# EAGLE design BIRDS-5_1U_+X-panel_EM_PUPV_v3.2 (EAGLE 9.6.2)
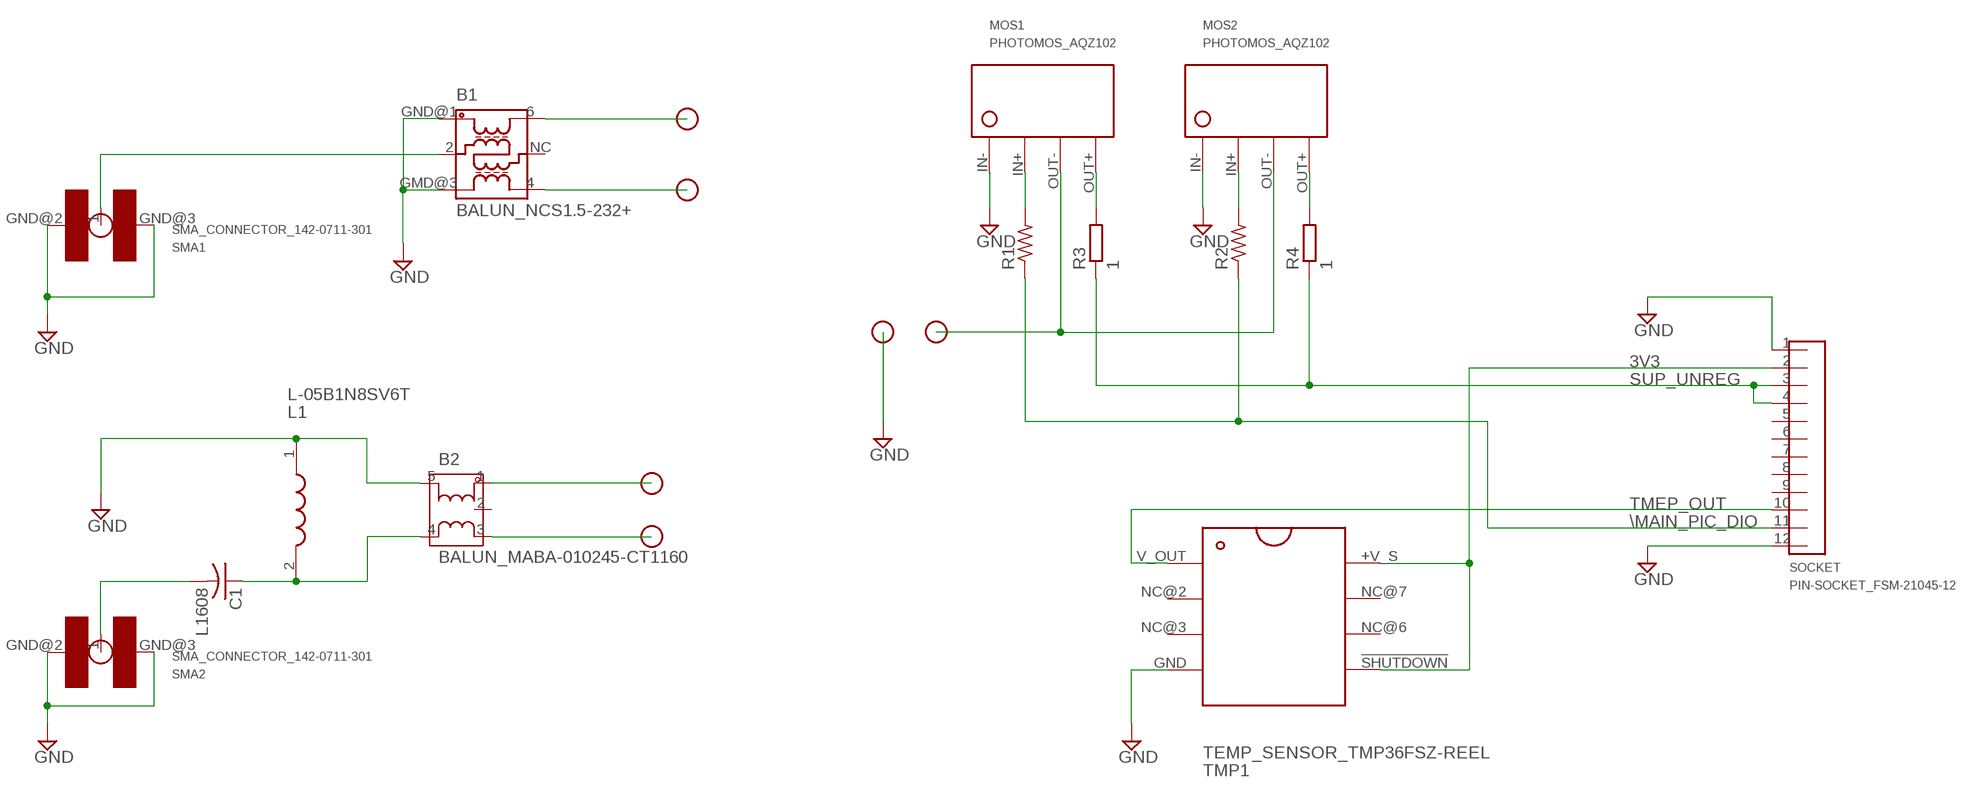
[diagram p0: schematic, sheet 1]

## Parts
B1  BALUN_NCS1.5-232+  [NCS1.5-232+]
B2  BALUN_MABA-010245-CT1160  [MABA-010245-CT1160]
C1  L1608  [L1608]
FD1  FEED_POINT_HEAT_KNIFE  [FEED_POINT_HEAT_KNIFE]
FD2  FEED_POINT_HEAT_KNIFE  [FEED_POINT_HEAT_KNIFE]
FP1_UHF  FEED_POINT  [FEED_POINT]
FP2_UHF  FEED_POINT  [FEED_POINT]
FP3  FEED_POINT  [FEED_POINT]
FP4  FEED_POINT  [FEED_POINT]
L1  L-05B1N8SV6T  [INDC0603X33N]
MOS1  PHOTOMOS_AQZ102  [AQZ102]
MOS2  PHOTOMOS_AQZ102  [AQZ102]
R1  R-US_R0402  [R0402]
R2  R-US_R0402  [R0402]
R3  1  R-EU_R1218  [R1218]
R4  1  R-EU_R1218  [R1218]
SMA1  SMA_CONNECTOR_142-0711-301  [142-0711-301]
SMA2  SMA_CONNECTOR_142-0711-301  [142-0711-301]
SOCKET  PIN-SOCKET_FSM-21045-12  [PIN-SOCKET_FSM-21045-12]
TMP1  TEMP_SENSOR_TMP36FSZ-REEL  [TMP36FSZ-REEL]

## Nets
3V3: SOCKET.2 TMP1.!SHUTDOWN! TMP1.+V_S
\MAIN_PIC_DIO: R1.1 R2.1 SOCKET.11
GND: B1.GMD@3(GND) B1.GND@1(GND) B2.5 FD2.FP(FEED_POINT) L1.1 MOS1.IN- MOS2.IN- SMA1.GND@2(GND) SMA1.GND@3(GMD) SMA2.GND@2(GND) SMA2.GND@3(GMD) SOCKET.1 SOCKET.12 TMP1.GND
N$1: MOS1.IN+ R1.2
N$4: MOS2.IN+ R2.2
N$6: MOS2.OUT+ R4.2
N$7: MOS1.OUT+ R3.2
N$9: FD1.FP(FEED_POINT) MOS1.OUT- MOS2.OUT-
N$10: B1.2 SMA1.1
N$11: C1.2 SMA2.1
N$14: B2.4 C1.1 L1.2
N$15: B2.1 FP3.FP(FEED_POINT)
N$16: B2.3 FP4.FP(FEED_POINT)
N$17: B1.6 FP1_UHF.FP(FEED_POINT)
N$18: B1.4 FP2_UHF.FP(FEED_POINT)
SUP_UNREG: R3.1 R4.1 SOCKET.3 SOCKET.4
TMEP_OUT: SOCKET.10 TMP1.V_OUT
Unconnected: B1.NC B2.2 SOCKET.5 SOCKET.6 SOCKET.7 SOCKET.8 SOCKET.9 TMP1.NC@2(NC) TMP1.NC@3(NC) TMP1.NC@6(NC) TMP1.NC@7(NC)

## Library data of the parts
B1 = balun_NCS1.5-232+:BALUN_NCS1.5-232+
B2 = balun_MABA-010245-CT1160:BALUN_MABA-010245-CT1160
C1 = adafruit_ufl:L1608
FD1 FD2 = feed_point:FEED_POINT_HEAT_KNIFE
FP1_UHF FP2_UHF FP3 FP4 = feed_point:FEED_POINT
L1 = L-05B1N8SV6T:L-05B1N8SV6T: RF CERAMIC CHIP INDUCTORS Source: Datasheet; DESCRIPTION: RF CERAMIC CHIP INDUCTORS; HEIGHT: 0.33mm; MANUFACTURER_NAME: JOHANSON TECHNOLOGY; MANUFACTURER_PART_NUMBER: L-05B1N8SV6T
MOS1 MOS2 = photoMOS_AQZ102:PHOTOMOS_AQZ102
R1 R2 = adafruit_ufl:R-US_: RESISTOR, American symbol
R3 R4 = rcl:R-EU_: RESISTOR, European symbol; SPICEPREFIX: R
SMA1 SMA2 = SMA_Connector_142-0711-301:SMA_CONNECTOR_142-0711-301
SOCKET = pin-socket_FSM-21045-12:PIN-SOCKET_FSM-21045-12
TMP1 = temp_sensor_TMP36FSZ-REEL:TEMP_SENSOR_TMP36FSZ-REEL

## Board
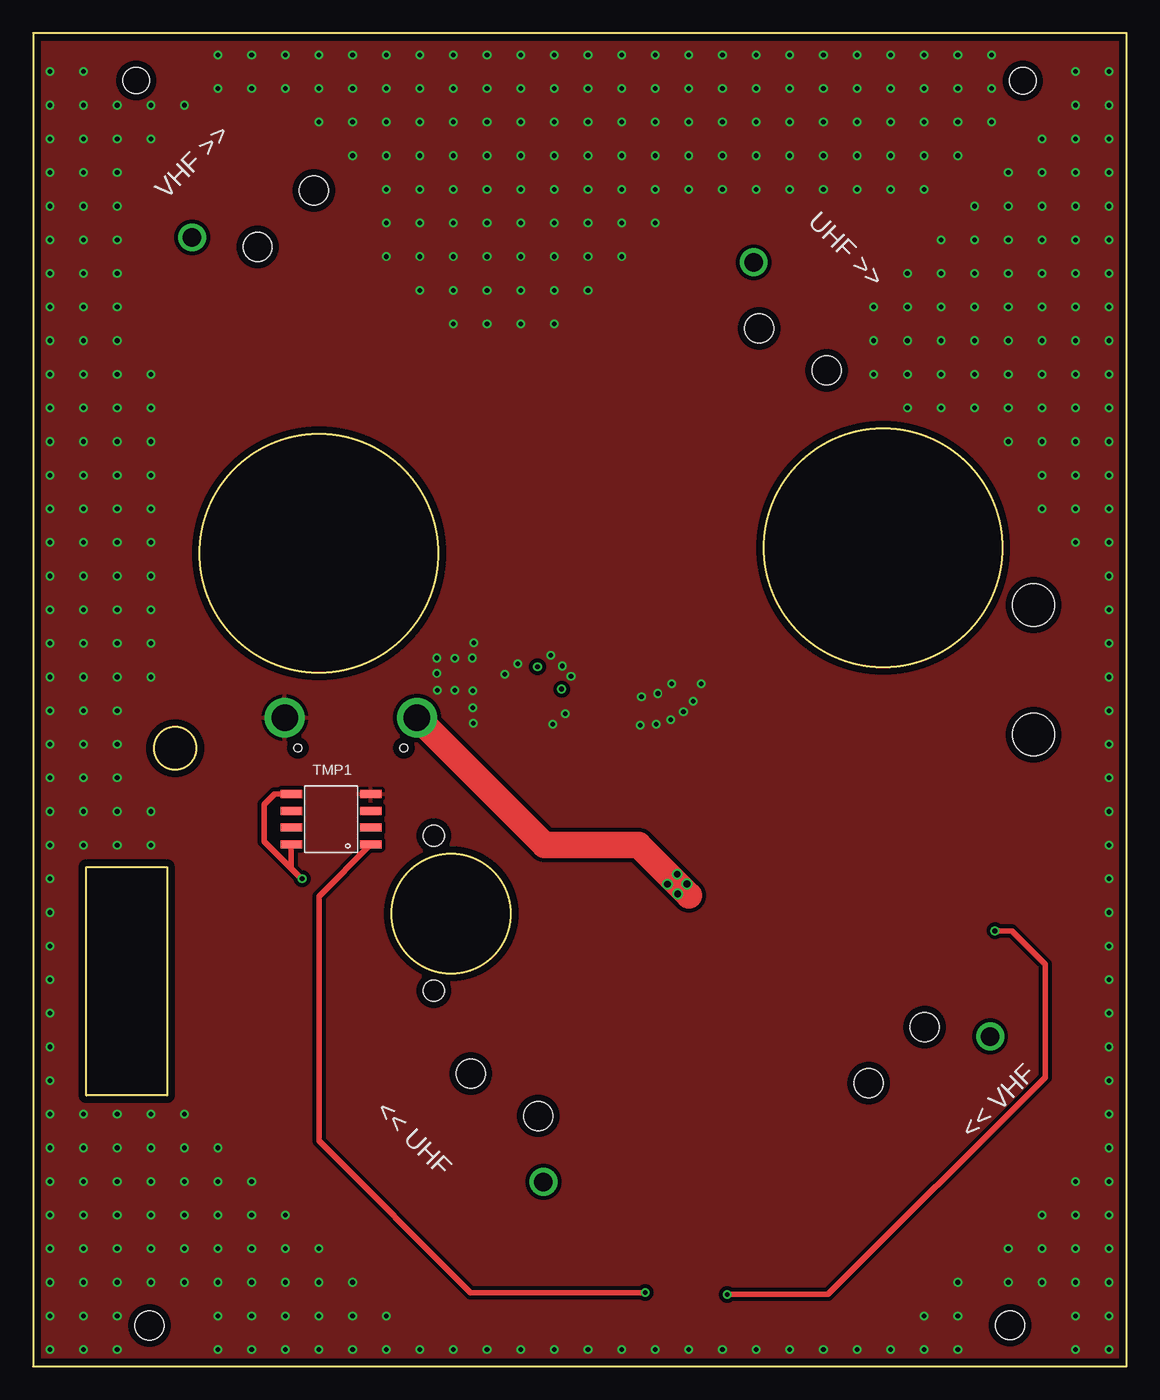
[diagram p1: board, top side]
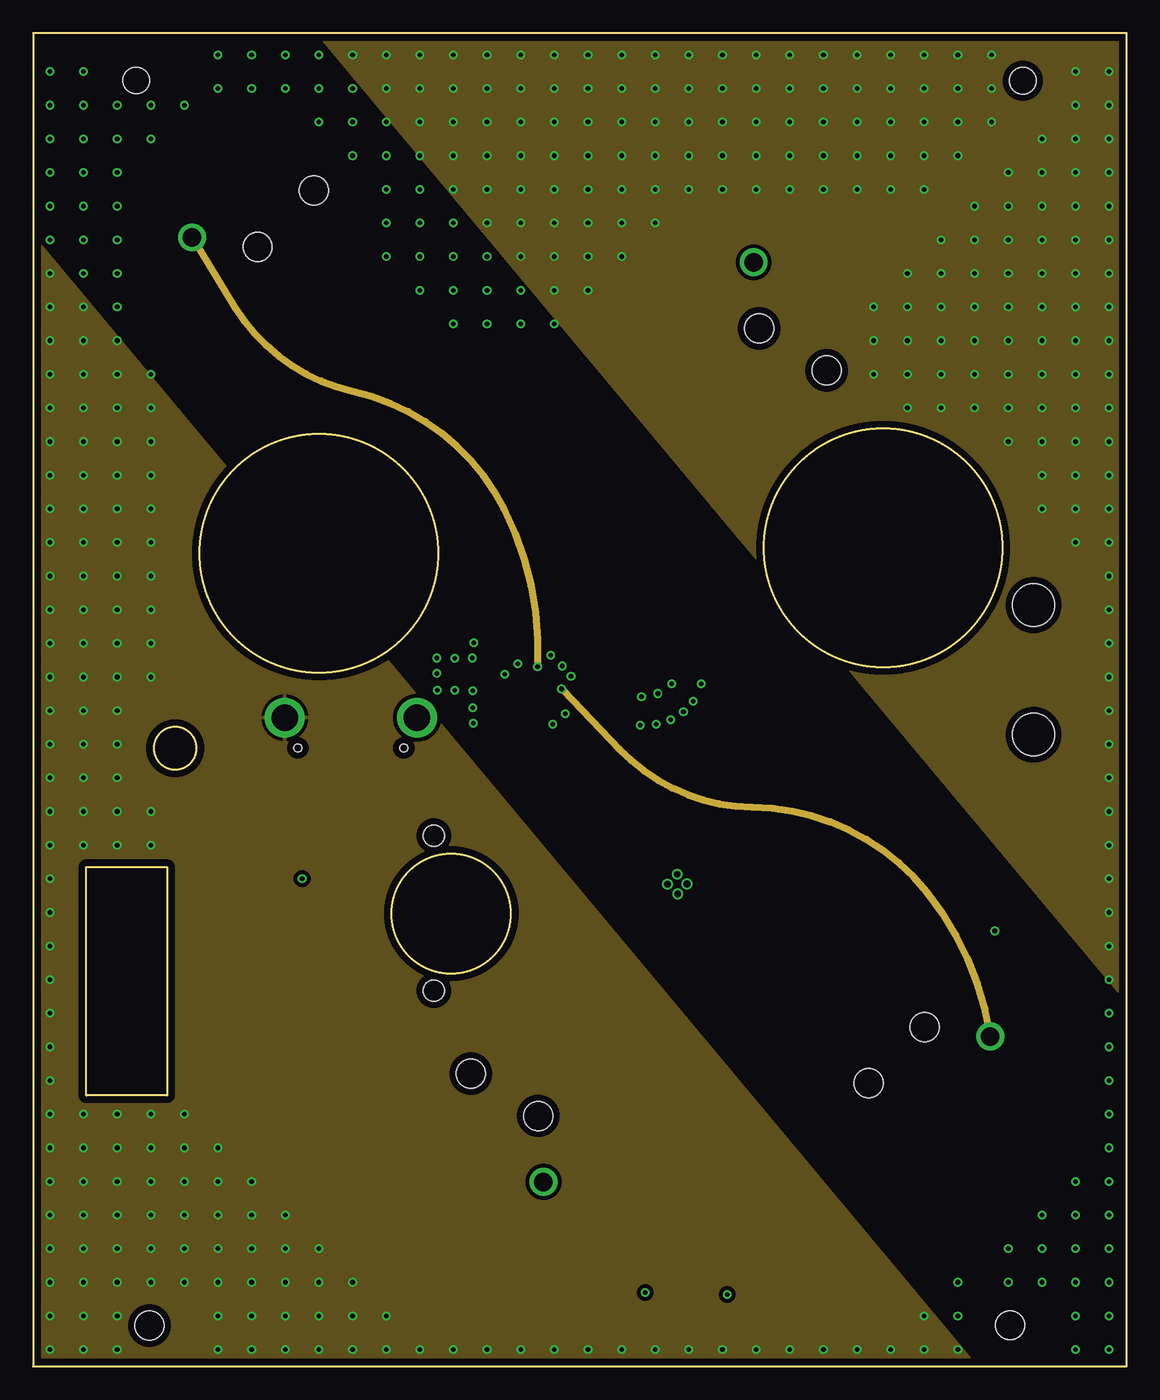
[diagram p2: board, inner layer Transmission_Line]
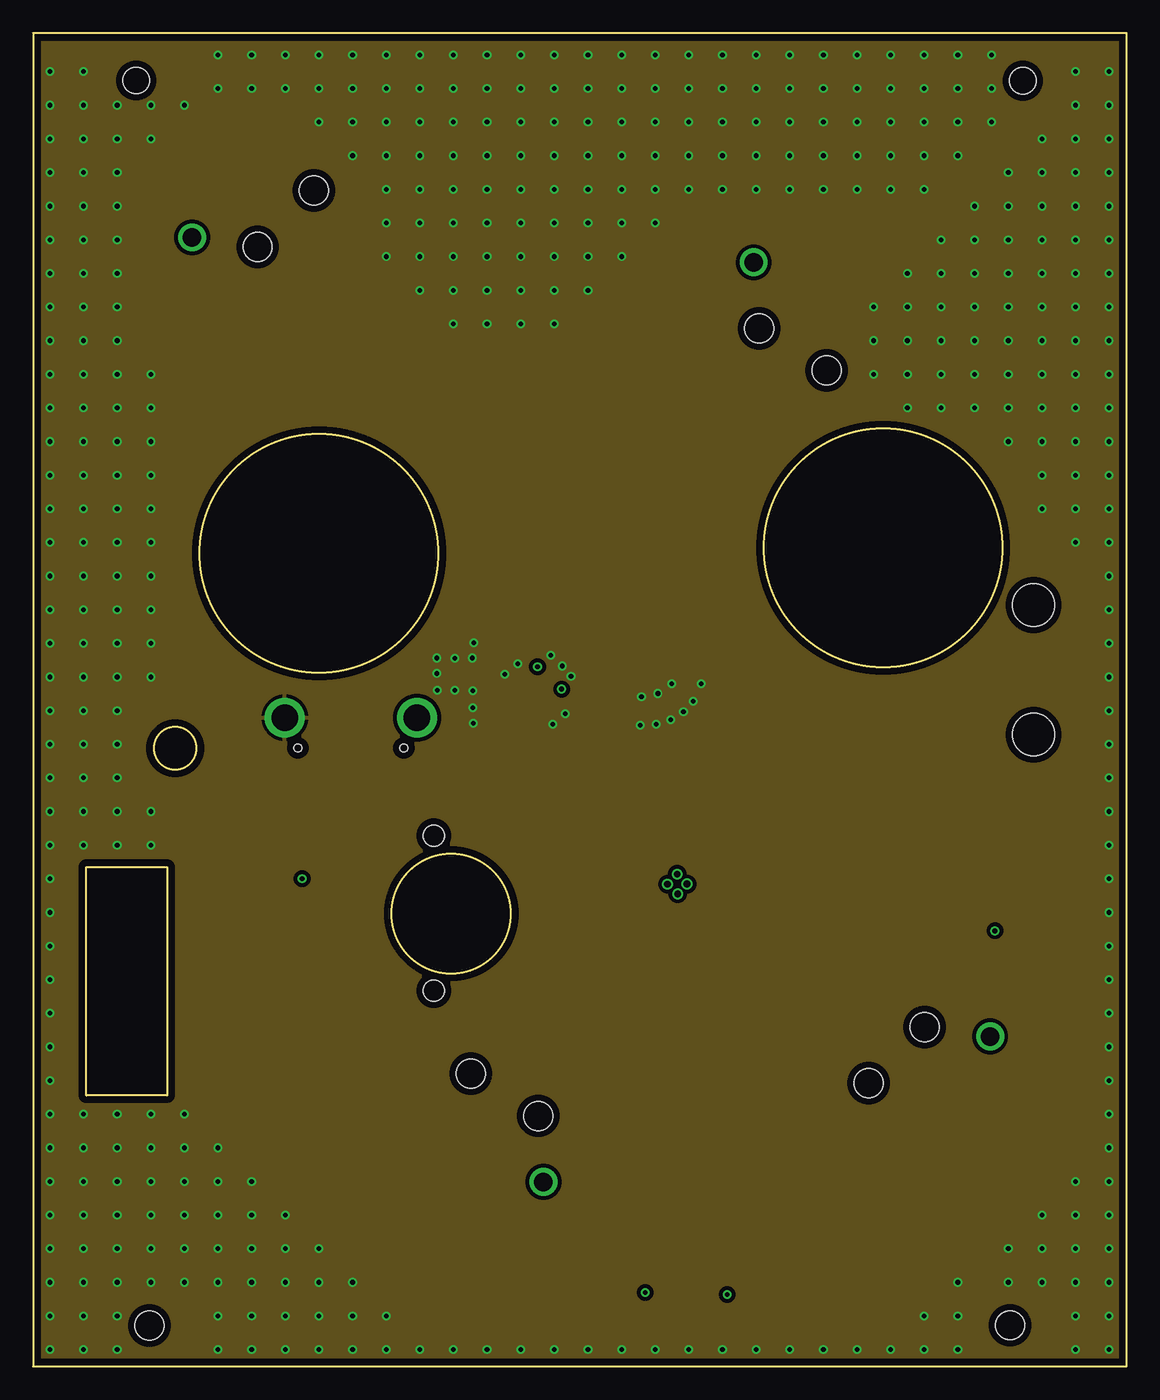
[diagram p3: board, inner layer GND]
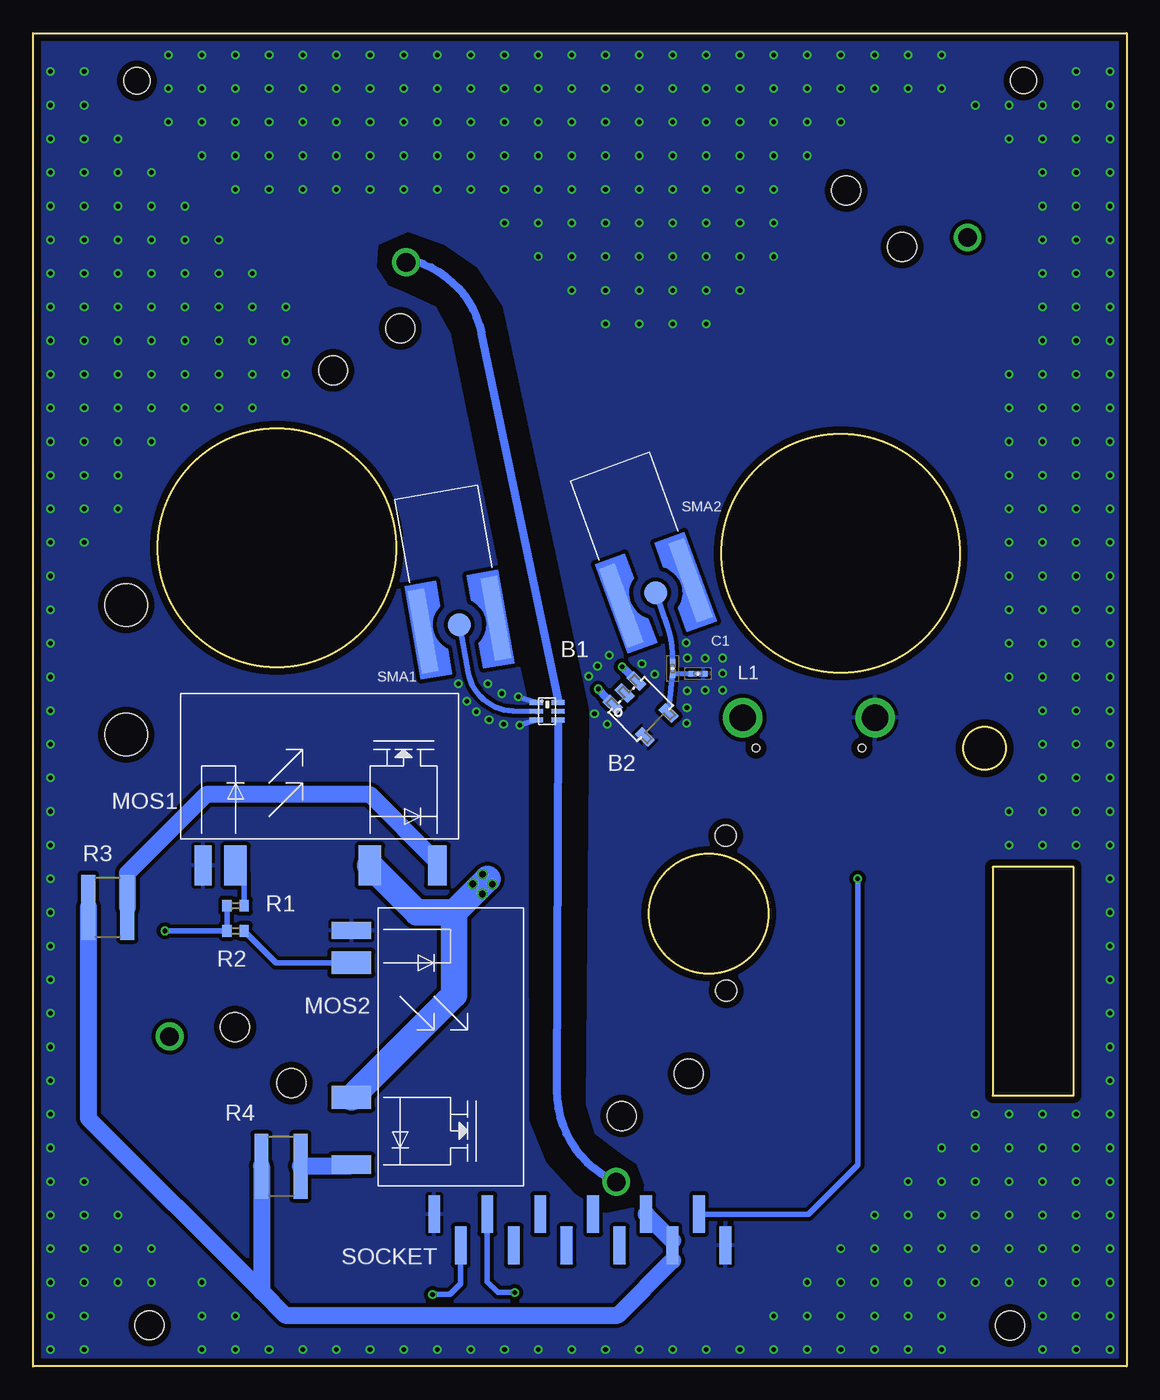
[diagram p4: board, bottom side, seen from below]

Size 82.6 x 100.7 mm. Coordinates in mm from the lower left corner, seen from the top.
Outline: 4.01,37.71 10.11,37.71 10.11,20.46 4.01,20.46 4.01,37.71
Outline: 82.6,100.7 0,100.7 0,0 82.6,0 82.6,100.7
Outline: circle at 31.58,34.2 radius 4.5
Outline: circle at 64.19,61.83 radius 9
Outline: circle at 21.6,61.41 radius 9
Outline: circle at 10.73,46.7 radius 1.6
Copper layers (1+2*15+16): Top 0.018mm / dielectric 0.23mm / Transmission_Line 0.035mm / dielectric 0.93mm / GND 0.035mm / dielectric 0.23mm / Bottom 0.018mm
Design rules "pban_5mil-l4 *": minimum track width 5mil, minimum drill 0.3mm, track to track 5mil, track to pad 0.229mm, pad to pad 5mil, via to via 5mil, smd to smd 5mil, copper to edge 0.5mm, drill to drill 0.5mm, minimum pad ring 0.15mm, minimum via ring 0.15mm, stop-mask expansion 2mil, vias tented up to drill 0.35mm, thermal gap 10mil
Holes 3.2 mm at 10.73,46.7 75.57,57.5 75.57,47.72
Holes 0.6 mm at 20,46.7 28,46.7
Holes 1.6 mm at 30.27,40.08 30.26,28.37
Holes 2 mm at 7.79,97.12 74.76,97.1
Holes 2.2 mm at 73.8,3.11 8.79,3.09

### Footprints (pad centres in the part's own frame; a part is rotated, then mirrored left to right if it is on the bottom)
NCS1.5-232+ = smd 0.356 x 0.991: 2 0,-0.813; 4 0.66,0.813; 6 -0.66,0.813; GMD@3 0.66,-0.813; GND@1 -0.66,-0.813; NC 0,0.813
MABA-010245-CT1160 = smd 0.762 x 1.397: 1 -1.27,1.714; 2 0,1.714; 3 1.27,1.714; 4 1.27,-1.714; 5 -1.27,-1.714
L1608 = smd 0.65 x 0.4: 1 -0.4,0; 2 0.4,0
FEED_POINT_HEAT_KNIFE = drill 2: FP 0,0
FEED_POINT = drill 1.4: FP 0,0 | hole 2.2: 3,-4; 9,-4
INDC0603X33N = smd 0.65 x 0.4: 1 -0.4,0; 2 0.4,0
AQZ102 = smd 1.7 x 3: IN+ -6.35,-7.5; OUT- 3.81,-7.5 | smd 1.3 x 3: IN- -8.8,-7.5 | smd 1.4 x 3: OUT+ 8.89,-7.5
R0402 = smd 0.7 x 0.9: 1 -0.65,0; 2 0.65,0
R1218 = smd 1.05 x 4.9: 1 -1.475,0; 2 1.475,0
142-0711-301 = smd 1.727 x 1.727: 1 0,0 | smd 1.27 x 6.35: GND@2 -2.794,0; GND@3 2.794,0
PIN-SOCKET_FSM-21045-12 = smd 0.89 x 2.85: 1 -11,1.175; 2 -9,-1.175; 3 -7,1.175; 4 -5,-1.175; 5 -3,1.175; 6 -1,-1.175; 7 1,1.175; 8 3,-1.175; 9 5,1.175; 10 7,-1.175; 11 9,1.175; 12 11,-1.175
TMP36FSZ-REEL = smd 1.6 x 0.6: !SHUTDOWN! 3,-1.905; +V_S 3,1.905; GND -3,-1.905; NC@2 -3,0.635; NC@3 -3,-0.635; NC@6 3,-0.635; NC@7 3,0.635; V_OUT -3,1.905

### Placement (x,y rotation side)
B1  43.78,49.48 270 bottom
B2  36.7,49.66 45 bottom
C1  34.29,52.7 90 bottom
FD1  29,49 0 top
FD2  19,49 0 top
FP1_UHF  54.43,83.39 328 top
FP2_UHF  38.55,13.94 147.8 top
FP3  72.29,24.92 225 top
FP4  12.01,85.27 45 top
L1  32.38,52.32 180 bottom
MOS1  60.96,45.34 0 bottom
MOS2  51.05,24.13 270 bottom
R1  67.31,34.8 0 bottom
R2  67.31,32.89 0 bottom
R3  76.96,34.67 0 bottom
R4  63.88,15.11 0 bottom
SMA1  50.39,56.02 190 bottom
SMA2  35.56,58.42 200 bottom
SOCKET  41.3,10.33 180 bottom
TMP1  22.5,41.33 180 top

### Tracks (layer width: path | path; a pad name or v marks a point on that pad's centre or on a via)
3V3  (via drill 0.35)
  Top 0.406: 19.5,37.61 TMP1.+V_S | TMP1.!SHUTDOWN! 18.23,43.23 17.45,42.44 17.45,39.67 19.5,37.61 | v20.32,36.83 20.28,36.83 19.5,37.61
  Bottom 0.406: SOCKET.2 24.05,11.51 20.32,15.24 v20.32,36.83
\MAIN_PIC_DIO  (via drill 0.35)
  Top 0.406: v72.64,32.89 73.91,32.89 76.45,30.35 76.45,21.84 60.05,5.44 v52.43,5.44
  Bottom 0.406: R1.1 R2.1 v72.64,32.89 | SOCKET.11 50.3,6.25 51.11,5.44 v52.43,5.44
GND  (via drill 0.35)
  Bottom 0.406: B1.GMD@3 v45.85,48.44 | B1.GND@1 v45.94,50.57
  Bottom 0.683: v45.94,50.57 v45.95,50.57
  other vias: 1.27,1.27 1.27,3.81 1.27,6.35 1.27,8.89 1.27,11.43 1.27,13.97 1.27,16.51 1.27,19.05 1.27,21.59 1.27,24.13 1.27,26.67 1.27,29.21 1.27,31.75 1.27,34.29 1.27,36.83 1.27,39.37 3.81,39.37 6.35,39.37 8.89,39.37 8.89,41.91 6.35,41.91 3.81,41.91 1.27,41.91 1.27,44.45 3.81,44.45 6.35,44.45 6.35,46.99 3.81,46.99 1.27,46.99 1.27,49.53 3.81,49.53 6.35,49.53 8.89,52.07 6.35,52.07 3.81,52.07 1.27,52.07 1.27,54.61 3.81,54.61 6.35,54.61 8.89,54.61 8.89,57.15 6.35,57.15 3.81,57.15 1.27,57.15 1.27,59.69 3.81,59.69 6.35,59.69 8.89,59.69 8.89,62.23 6.35,62.23 3.81,62.23 1.27,62.23 1.27,64.77 3.81,64.77 6.35,64.77 8.89,64.77 8.89,67.31 6.35,67.31 3.81,67.31 1.27,67.31 1.27,69.85 3.81,69.85 6.35,69.85 8.89,69.85 8.89,72.39 8.89,74.93 6.35,74.93 6.35,72.39 3.81,72.39 1.27,72.39 1.27,74.93 3.81,74.93 6.35,77.47 3.81,77.47 1.27,77.47 1.27,80.01 3.81,80.01 6.35,80.01 6.35,82.55 3.81,82.55 1.27,82.55 1.27,85.09 3.81,85.09 6.35,85.09 6.35,87.63 3.81,87.63 1.27,87.63 1.27,90.17 3.81,90.17 6.35,90.17 6.35,92.71 6.35,95.25 3.81,95.25 3.81,92.71 1.27,92.71 1.27,95.25 1.27,97.79 3.81,97.79 8.89,95.25 8.89,92.71 11.43,95.25 13.97,96.52 13.97,99.06 16.51,99.06 16.51,96.52 19.05,99.06 21.59,99.06 24.13,99.06 26.67,99.06 29.21,99.06 31.75,99.06 34.29,99.06 36.83,99.06 39.37,99.06 41.91,99.06 44.45,99.06 46.99,99.06 49.53,99.06 52.07,99.06 52.07,96.52 49.53,96.52 46.99,96.52 44.45,96.52 41.91,96.52 39.37,96.52 36.83,96.52 34.29,96.52 31.75,96.52 29.21,96.52 26.67,96.52 24.13,96.52 21.59,96.52 19.05,96.52 21.59,93.98 24.13,93.98 26.67,93.98 29.21,93.98 31.75,93.98 34.29,93.98 36.83,93.98 39.37,93.98 41.91,93.98 44.45,93.98 46.99,93.98 49.53,93.98 52.07,93.98 52.07,91.44 52.07,88.9 49.53,88.9 49.53,91.44 46.99,91.44 44.45,91.44 41.91,91.44 39.37,91.44 36.83,91.44 34.29,91.44 31.75,91.44 29.21,91.44 26.67,91.44 24.13,91.44 26.67,88.9 29.21,88.9 31.75,88.9 34.29,88.9 36.83,88.9 39.37,88.9 41.91,88.9 44.45,88.9 46.99,88.9 46.99,86.36 44.45,86.36 41.91,86.36 36.83,86.36 34.29,86.36 31.75,86.36 29.21,86.36 26.67,86.36 26.67,83.82 29.21,83.82 29.21,81.28 31.75,81.28 31.75,83.82 34.29,83.82 34.29,81.28 34.29,78.74 31.75,78.74 36.83,78.74 39.37,78.74 39.37,81.28 36.83,83.82 36.83,81.28 39.37,83.82 41.91,83.82 41.91,81.28 44.45,83.82 39.37,86.36 54.61,99.06 57.15,99.06 59.69,99.06 62.23,99.06 64.77,99.06 67.31,99.06 69.85,99.06 72.39,99.06 72.39,96.52 72.39,93.98 69.85,93.98 69.85,91.44 69.85,96.52 67.31,96.52 64.77,96.52 62.23,96.52 59.69,96.52 57.15,96.52 54.61,96.52 54.61,93.98 57.15,93.98 59.69,93.98 62.23,93.98 64.77,93.98 67.31,91.44 64.77,91.44 62.23,91.44 59.69,91.44 57.15,91.44 54.61,91.44 54.61,88.9 57.15,88.9 59.69,88.9 64.77,88.9 67.31,88.9 67.31,93.98 62.23,88.9 81.28,97.79 81.28,95.25 81.28,92.71 81.28,90.17 81.28,87.63 81.28,85.09 81.28,82.55 78.74,82.55 78.74,85.09 78.74,87.63 78.74,90.17 78.74,95.25 78.74,97.79 76.2,92.71 76.2,90.17 76.2,87.63 76.2,85.09 76.2,82.55 73.66,82.55 73.66,85.09 73.66,87.63 73.66,90.17 71.12,82.55 68.58,85.09 66.04,82.55 78.74,92.71 71.12,87.63 71.12,85.09 68.58,82.55 63.5,80.01 63.5,77.47 63.5,74.93 66.04,72.39 66.04,74.93 66.04,77.47 66.04,80.01 68.58,80.01 68.58,77.47 68.58,74.93 68.58,72.39 71.12,72.39 71.12,74.93 71.12,77.47 71.12,80.01 73.66,80.01 73.66,77.47 73.66,74.93 73.66,72.39 73.66,69.85 76.2,80.01 76.2,77.47 76.2,74.93 76.2,72.39 76.2,69.85 76.2,67.31 76.2,64.77 78.74,64.77 78.74,67.31 78.74,69.85 78.74,72.39 78.74,74.93 78.74,77.47 78.74,80.01 81.28,80.01 81.28,77.47 81.28,74.93 81.28,72.39 81.28,69.85 81.28,67.31 81.28,64.77 78.74,62.23 81.28,62.23 81.28,59.69 81.28,57.15 81.28,54.61 81.28,52.07 81.28,49.53 81.28,46.99 81.28,44.45 81.28,41.91 81.28,39.37 81.28,36.83 81.28,34.29 81.28,31.75 81.28,29.21 81.28,26.67 81.28,24.13 81.28,21.59 81.28,19.05 81.28,16.51 81.28,13.97 78.74,13.97 76.2,11.43 76.2,8.89 78.74,11.43 78.74,8.89 81.28,11.43 81.28,8.89 73.66,8.89 81.28,6.35 81.28,3.81 81.28,1.27 78.74,1.27 78.74,3.81 78.74,6.35 76.2,6.35 69.85,6.35 69.85,3.81 69.85,1.27 67.31,3.81 67.31,1.27 73.66,6.35 64.77,1.27 62.23,1.27 59.69,1.27 57.15,1.27 54.61,1.27 52.07,1.27 49.53,1.27 46.99,1.27 44.45,1.27 41.91,1.27 39.37,1.27 36.83,1.27 34.29,1.27 31.75,1.27 29.21,1.27 26.67,1.27 26.67,3.81 3.81,19.05 3.81,16.51 3.81,13.97 3.81,11.43 3.81,8.89 3.81,6.35 3.81,3.81 3.81,1.27 6.35,1.27 6.35,3.81 6.35,6.35 6.35,8.89 6.35,11.43 6.35,13.97 6.35,16.51 6.35,19.05 8.89,19.05 8.89,16.51 8.89,13.97 8.89,11.43 8.89,6.35 11.43,19.05 11.43,16.51 11.43,13.97 11.43,11.43 11.43,8.89 8.89,8.89 11.43,6.35 13.97,16.51 13.97,13.97 13.97,11.43 13.97,8.89 13.97,6.35 13.97,3.81 13.97,1.27 16.51,1.27 16.51,3.81 16.51,6.35 16.51,8.89 16.51,11.43 16.51,13.97 19.05,11.43 19.05,8.89 19.05,6.35 19.05,3.81 19.05,1.27 21.59,1.27 24.13,1.27 24.13,3.81 21.59,3.81 21.59,6.35 24.13,6.35 21.59,8.89 33.27,54.66 33.17,53.51 33.2,51.03 31.84,51.07 30.52,51.08 30.51,52.34 30.51,53.51 31.84,53.49 33.21,49.76 33.24,48.58 35.64,52.27 36.61,53.07 39.24,48.49 40.2,49.29 40.63,52.12 39.97,52.9 39.09,53.72 47.19,50.83 50.47,51.55 49.85,50.24 49.12,49.45 48.16,48.83 47.07,48.51 48.25,51.55
  pour Bottom (isolate 0.3): -1.27,101.6 -1.27,-1.27 83.82,-1.27 83.82,101.6
  pour GND (isolate 0.3): -2.54,102.87 -2.54,-2.54 85.09,-2.54 85.09,102.87
  pour Top (isolate 0.3): -5.08,105.41 -5.08,-5.08 87.63,-5.08 87.63,105.41
  pour Transmission_Line (isolate 0.3): -3.81,89.94 -3.81,-3.81 74.5,-3.81
  pour Transmission_Line (isolate 0.3): 18.6,104.14 86.36,23.02 86.36,104.14
GND1
  cutout Bottom: 45.09,36.98 45.05,18.61 43.78,15.43 41.65,13.15 39.25,11.67 36.93,12.15 36.5,13.69 37.07,15.18 38.08,15.87 40.25,17.49 40.92,19.76 40.66,49.52 41.78,50.12 45.1,48.65 45.09,36.95 45.08,36.94
GND3
  cutout Bottom: 47.18,80.01 49.09,82.85 51.64,84.65 54.29,85.6 56.46,84.65 56.57,83.05 55.7,81.71 54.57,81.24 52.11,80.11 50.98,78.03 46.99,58.43 45.05,49.84 41.87,48.93 40.7,49.78
N$1
  Bottom 0.152: MOS1.IN+ 66.67,37.2 | R1.2 66.67,34.81
  Bottom 0.406: 66.67,37.2 66.67,34.81
N$4
  Bottom 0.406: MOS2.IN+ 64.25,30.48 R2.2
N$6
  Bottom 0.152: MOS2.OUT+ 58.72,15.11
  Bottom 1.27: 58.72,15.11 R4.2
N$7
  Bottom 0.152: MOS1.OUT+ 52.07,38.1
  Bottom 1.27: 52.07,38.1 57.15,43.18 69.54,43.18 75.49,37.23 R3.2
N$9  (via drill 0.5)
  Top 0.305: 49.53,35.56 v48.68,35.69
  Top 2: FD1.FP 38.65,39.37 45.72,39.37 49.53,35.56
  Bottom 0.305: v48.68,35.69 v49.39,36.44 v48.65,37.17 v47.92,36.41 48.26,36.83
  Bottom 2: MOS2.OUT- 50.8,28.07 50.8,34.29 | MOS1.OUT- 53.6,34.29 50.8,34.29 | 48.26,36.83 50.8,34.29
N$10
  Bottom 0.431: SMA1.1 49.76,52.46 arc-77 46.35,49.49 B1.2
N$11
  Bottom 0.127: C1.2 34.29,53.34
  Bottom 0.431: SMA2.1 34.67,55.88 arc22 34.29,53.34
N$14
  Bottom 0.431: L1.2 C1.1 B2.4
N$15  (via drill 0.35)
  Transmission_Line 0.152: v39.91,51.16 40.04,51.09 | 72.29,25.07 72.29,25.09
  Transmission_Line 0.2: FP3.FP 72.29,25.07
  Transmission_Line 0.52: 40.04,51.09 44.29,46.61 arc46 54.31,42.25 arc-50 67.49,35.85 arc-30 72.29,25.09
  Bottom 0.602: v39.91,51.16 B2.1
N$16  (via drill 0.35)
  Transmission_Line 0.52: FP4.FP 15.24,80.01 arc46 24.13,73.66 arc-50 35.56,64.77 arc-30 v38.1,52.83
  Bottom 0.602: v38.1,52.83 B2.3
N$17
  Bottom 0.254: B1.6 42.78,50.32 42.93,50.31 | FP1_UHF.FP 54.36,83.63
  Bottom 0.602: 42.93,50.31 48.73,78.02 arc-66 54.36,83.63
N$18
  Bottom 0.2: B1.4 42.96,48.65
  Bottom 0.602: FP2_UHF.FP arc66 43.05,20.85 42.96,48.65
SUP_UNREG
  Bottom 0.152: 34.3,8.01 SOCKET.3 34.29,9.49
  Bottom 1.27: R3.1 78.44,18.75 65.36,5.67 | 65.36,5.67 63.56,3.87 38.44,3.87 34.3,8.01 | SOCKET.4 34.29,9.49 | R4.1 65.36,5.67
TMEP_OUT  (via drill 0.35)
  Top 0.406: TMP1.V_OUT 21.59,35.51 21.59,17.02 33.05,5.56 46.2,5.56 v46.23,5.59
  Bottom 0.406: SOCKET.10 48.3,6.39 47.5,5.59 v46.23,5.59

### Text on the board
tPlace: VHF >> | UHF >> | << VHF | << UHF